# EAGLE design PowerBus (EAGLE 7.7.0)
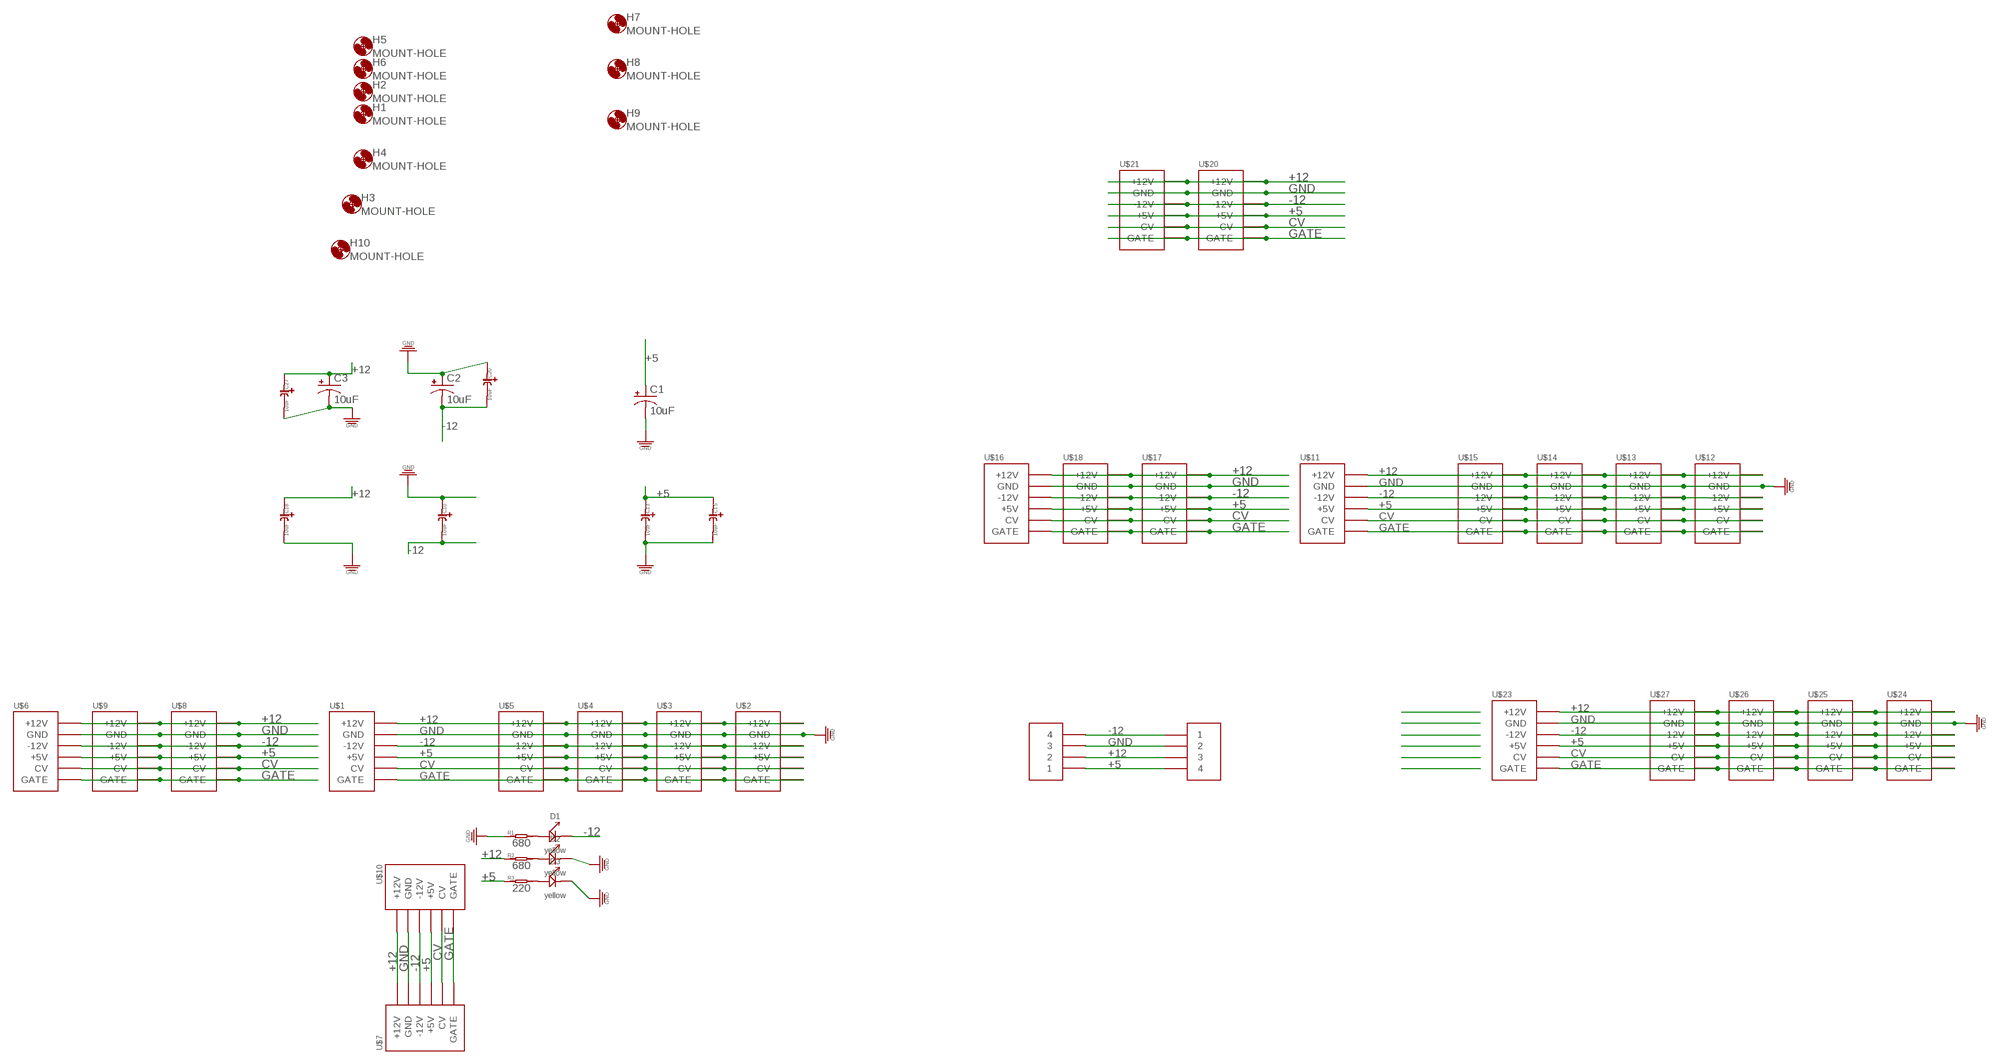
[diagram p0: schematic, sheet 1]

## Parts
C1  10uF  CAP_POLD  [PANASONIC_D]
C2  10uF  CAP_POLD  [PANASONIC_D]
C3  10uF  CAP_POLD  [PANASONIC_D]
C10  10uF  C-POLAR-A  [CASE-A_3216]
C13  10uF  C-POLAR-A  [CASE-A_3216]
C15  10uF  C-POLAR-A  [CASE-A_3216]
C18  10uF  C-POLAR-A  [CASE-A_3216]
C20  10uF  C-POLAR-A  [CASE-A_3216]
C27  10uF  C-POLAR-A  [CASE-A_3216]
D1  yellow  LED  [LED0603]
D2  yellow  LED  [LED0603]
D3  yellow  LED  [LED0603]
H1  MOUNT-HOLE  [3.2-NOMARKINGS-SMALLSAFEZONE]
H2  MOUNT-HOLE  [3.2-NOMARKINGS-SMALLSAFEZONE]
H3  MOUNT-HOLE  [3.2-NOMARKINGS-SMALLSAFEZONE]
H4  MOUNT-HOLE  [3.2-NOMARKINGS-SMALLSAFEZONE]
H5  MOUNT-HOLE  [3.2-NOMARKINGS-SMALLSAFEZONE]
H6  MOUNT-HOLE  [3.2-NOMARKINGS-SMALLSAFEZONE]
H7  MOUNT-HOLE  [3.2-NOMARKINGS-SMALLSAFEZONE]
H8  MOUNT-HOLE  [3.2-NOMARKINGS-SMALLSAFEZONE]
H9  MOUNT-HOLE  [3.2-NOMARKINGS-SMALLSAFEZONE]
H10  MOUNT-HOLE  [3.2-NOMARKINGS-SMALLSAFEZONE]
R1  680  R-0603  [R0603]
R2  680  R-0603  [R0603]
R3  220  R-0603  [R0603]
U$1  POWER_SHROUDED_NOTEXT  [POWER_16_SHROUDED_NOTEXT]
U$2  POWER_SHROUDED_NOTEXT  [POWER_16_SHROUDED_NOTEXT]
U$3  POWER_SHROUDED_NOTEXT  [POWER_16_SHROUDED_NOTEXT]
U$4  POWER_SHROUDED_NOTEXT  [POWER_16_SHROUDED_NOTEXT]
U$5  POWER_SHROUDED_NOTEXT  [POWER_16_SHROUDED_NOTEXT]
U$6  POWER_SHROUDED_NOTEXT  [POWER_16_SHROUDED_NOTEXT]
U$7  POWER_SHROUDED_NOTEXT  [POWER_16_SHROUDED_NOTEXT]
U$8  POWER_SHROUDED_NOTEXT  [POWER_16_SHROUDED_NOTEXT]
U$9  POWER_SHROUDED_NOTEXT  [POWER_16_SHROUDED_NOTEXT]
U$10  POWER_SHROUDED_NOTEXT  [POWER_16_SHROUDED_NOTEXT]
U$11  POWER_SHROUDED_NOTEXT  [POWER_16_SHROUDED_NOTEXT]
U$12  POWER_SHROUDED_NOTEXT  [POWER_16_SHROUDED_NOTEXT]
U$13  POWER_SHROUDED_NOTEXT  [POWER_16_SHROUDED_NOTEXT]
U$14  POWER_SHROUDED_NOTEXT  [POWER_16_SHROUDED_NOTEXT]
U$15  POWER_SHROUDED_NOTEXT  [POWER_16_SHROUDED_NOTEXT]
U$16  POWER_SHROUDED_NOTEXT  [POWER_16_SHROUDED_NOTEXT]
U$17  POWER_SHROUDED_NOTEXT  [POWER_16_SHROUDED_NOTEXT]
U$18  POWER_SHROUDED_NOTEXT  [POWER_16_SHROUDED_NOTEXT]
U$19  4PIN5MM  [4PIN5MM]
U$20  POWER_SHROUDED_NOTEXT  [POWER_16_SHROUDED_NOTEXT]
U$21  POWER_SHROUDED_NOTEXT  [POWER_16_SHROUDED_NOTEXT]
U$22  4PIN5MM  [4PIN5MM]
U$23  POWER_SHROUDED_NOTEXT  [POWER_16_SHROUDED_NOTEXT]
U$24  POWER_SHROUDED_NOTEXT  [POWER_16_SHROUDED_NOTEXT]
U$25  POWER_SHROUDED_NOTEXT  [POWER_16_SHROUDED_NOTEXT]
U$26  POWER_SHROUDED_NOTEXT  [POWER_16_SHROUDED_NOTEXT]
U$27  POWER_SHROUDED_NOTEXT  [POWER_16_SHROUDED_NOTEXT]

## Nets
+5 [Powertrace]: C1.+ C13.+ C15.+ R3.1 U$1.11(+5V) U$1.12(+5V) U$2.11(+5V) U$2.12(+5V) U$3.11(+5V) U$3.12(+5V) U$4.11(+5V) U$4.12(+5V) U$5.11(+5V) U$5.12(+5V) U$6.11(+5V) U$6.12(+5V) U$7.11(+5V) U$7.12(+5V) U$8.11(+5V) U$8.12(+5V) U$9.11(+5V) U$9.12(+5V) U$10.11(+5V) U$10.12(+5V) U$11.11(+5V) U$11.12(+5V) U$12.11(+5V) U$12.12(+5V) U$13.11(+5V) U$13.12(+5V) U$14.11(+5V) U$14.12(+5V) U$15.11(+5V) U$15.12(+5V) U$16.11(+5V) U$16.12(+5V) U$17.11(+5V) U$17.12(+5V) U$18.11(+5V) U$18.12(+5V) U$19.4 U$20.11(+5V) U$20.12(+5V) U$21.11(+5V) U$21.12(+5V) U$22.1 U$23.11(+5V) U$23.12(+5V) U$24.11(+5V) U$24.12(+5V) U$25.11(+5V) U$25.12(+5V) U$26.11(+5V) U$26.12(+5V) U$27.11(+5V) U$27.12(+5V)
+12 [Powertrace]: C3.+ C18.+ C27.+ R2.1 U$1.9(+12V) U$1.10(+12V) U$2.9(+12V) U$2.10(+12V) U$3.9(+12V) U$3.10(+12V) U$4.9(+12V) U$4.10(+12V) U$5.9(+12V) U$5.10(+12V) U$6.9(+12V) U$6.10(+12V) U$7.9(+12V) U$7.10(+12V) U$8.9(+12V) U$8.10(+12V) U$9.9(+12V) U$9.10(+12V) U$10.9(+12V) U$10.10(+12V) U$11.9(+12V) U$11.10(+12V) U$12.9(+12V) U$12.10(+12V) U$13.9(+12V) U$13.10(+12V) U$14.9(+12V) U$14.10(+12V) U$15.9(+12V) U$15.10(+12V) U$16.9(+12V) U$16.10(+12V) U$17.9(+12V) U$17.10(+12V) U$18.9(+12V) U$18.10(+12V) U$19.3 U$20.9(+12V) U$20.10(+12V) U$21.9(+12V) U$21.10(+12V) U$22.2 U$23.9(+12V) U$23.10(+12V) U$24.9(+12V) U$24.10(+12V) U$25.9(+12V) U$25.10(+12V) U$26.9(+12V) U$26.10(+12V) U$27.9(+12V) U$27.10(+12V)
-12 [Powertrace]: C2.- C10.- C20.- D1.- U$1.1(-12V) U$1.2(-12V) U$2.1(-12V) U$2.2(-12V) U$3.1(-12V) U$3.2(-12V) U$4.1(-12V) U$4.2(-12V) U$5.1(-12V) U$5.2(-12V) U$6.1(-12V) U$6.2(-12V) U$7.1(-12V) U$7.2(-12V) U$8.1(-12V) U$8.2(-12V) U$9.1(-12V) U$9.2(-12V) U$10.1(-12V) U$10.2(-12V) U$11.1(-12V) U$11.2(-12V) U$12.1(-12V) U$12.2(-12V) U$13.1(-12V) U$13.2(-12V) U$14.1(-12V) U$14.2(-12V) U$15.1(-12V) U$15.2(-12V) U$16.1(-12V) U$16.2(-12V) U$17.1(-12V) U$17.2(-12V) U$18.1(-12V) U$18.2(-12V) U$19.1 U$20.1(-12V) U$20.2(-12V) U$21.1(-12V) U$21.2(-12V) U$22.4 U$23.1(-12V) U$23.2(-12V) U$24.1(-12V) U$24.2(-12V) U$25.1(-12V) U$25.2(-12V) U$26.1(-12V) U$26.2(-12V) U$27.1(-12V) U$27.2(-12V)
CV [Powertrace]: U$1.13(CV) U$1.14(CV) U$2.13(CV) U$2.14(CV) U$3.13(CV) U$3.14(CV) U$4.13(CV) U$4.14(CV) U$5.13(CV) U$5.14(CV) U$6.13(CV) U$6.14(CV) U$7.13(CV) U$7.14(CV) U$8.13(CV) U$8.14(CV) U$9.13(CV) U$9.14(CV) U$10.13(CV) U$10.14(CV) U$11.13(CV) U$11.14(CV) U$12.13(CV) U$12.14(CV) U$13.13(CV) U$13.14(CV) U$14.13(CV) U$14.14(CV) U$15.13(CV) U$15.14(CV) U$16.13(CV) U$16.14(CV) U$17.13(CV) U$17.14(CV) U$18.13(CV) U$18.14(CV) U$20.13(CV) U$20.14(CV) U$21.13(CV) U$21.14(CV) U$23.13(CV) U$23.14(CV) U$24.13(CV) U$24.14(CV) U$25.13(CV) U$25.14(CV) U$26.13(CV) U$26.14(CV) U$27.13(CV) U$27.14(CV)
GATE [Powertrace]: U$1.15(GATE) U$1.16(GATE) U$2.15(GATE) U$2.16(GATE) U$3.15(GATE) U$3.16(GATE) U$4.15(GATE) U$4.16(GATE) U$5.15(GATE) U$5.16(GATE) U$6.15(GATE) U$6.16(GATE) U$7.15(GATE) U$7.16(GATE) U$8.15(GATE) U$8.16(GATE) U$9.15(GATE) U$9.16(GATE) U$10.15(GATE) U$10.16(GATE) U$11.15(GATE) U$11.16(GATE) U$12.15(GATE) U$12.16(GATE) U$13.15(GATE) U$13.16(GATE) U$14.15(GATE) U$14.16(GATE) U$15.15(GATE) U$15.16(GATE) U$16.15(GATE) U$16.16(GATE) U$17.15(GATE) U$17.16(GATE) U$18.15(GATE) U$18.16(GATE) U$20.15(GATE) U$20.16(GATE) U$21.15(GATE) U$21.16(GATE) U$23.15(GATE) U$23.16(GATE) U$24.15(GATE) U$24.16(GATE) U$25.15(GATE) U$25.16(GATE) U$26.15(GATE) U$26.16(GATE) U$27.15(GATE) U$27.16(GATE)
GND: C1.- C2.+ C3.- C10.+ C13.- C15.- C18.- C20.+ C27.- D2.- D3.- R1.1 U$1.3(GND) U$1.4(GND) U$1.5(GND) U$1.6(GND) U$1.7(GND) U$1.8(GND) U$2.3(GND) U$2.4(GND) U$2.5(GND) U$2.6(GND) U$2.7(GND) U$2.8(GND) U$3.3(GND) U$3.4(GND) U$3.5(GND) U$3.6(GND) U$3.7(GND) U$3.8(GND) U$4.3(GND) U$4.4(GND) U$4.5(GND) U$4.6(GND) U$4.7(GND) U$4.8(GND) U$5.3(GND) U$5.4(GND) U$5.5(GND) U$5.6(GND) U$5.7(GND) U$5.8(GND) U$6.3(GND) U$6.4(GND) U$6.5(GND) U$6.6(GND) U$6.7(GND) U$6.8(GND) U$7.3(GND) U$7.4(GND) U$7.5(GND) U$7.6(GND) U$7.7(GND) U$7.8(GND) U$8.3(GND) U$8.4(GND) U$8.5(GND) U$8.6(GND) U$8.7(GND) U$8.8(GND) U$9.3(GND) U$9.4(GND) U$9.5(GND) U$9.6(GND) U$9.7(GND) U$9.8(GND) U$10.3(GND) U$10.4(GND) U$10.5(GND) U$10.6(GND) U$10.7(GND) U$10.8(GND) U$11.3(GND) U$11.4(GND) U$11.5(GND) U$11.6(GND) U$11.7(GND) U$11.8(GND) U$12.3(GND) U$12.4(GND) U$12.5(GND) U$12.6(GND) U$12.7(GND) U$12.8(GND) U$13.3(GND) U$13.4(GND) U$13.5(GND) U$13.6(GND) U$13.7(GND) U$13.8(GND) U$14.3(GND) U$14.4(GND) U$14.5(GND) U$14.6(GND) U$14.7(GND) U$14.8(GND) U$15.3(GND) U$15.4(GND) U$15.5(GND) U$15.6(GND) U$15.7(GND) U$15.8(GND) U$16.3(GND) U$16.4(GND) U$16.5(GND) U$16.6(GND) U$16.7(GND) U$16.8(GND) U$17.3(GND) U$17.4(GND) U$17.5(GND) U$17.6(GND) U$17.7(GND) U$17.8(GND) U$18.3(GND) U$18.4(GND) U$18.5(GND) U$18.6(GND) U$18.7(GND) U$18.8(GND) U$19.2 U$20.3(GND) U$20.4(GND) U$20.5(GND) U$20.6(GND) U$20.7(GND) U$20.8(GND) U$21.3(GND) U$21.4(GND) U$21.5(GND) U$21.6(GND) U$21.7(GND) U$21.8(GND) U$22.3 U$23.3(GND) U$23.4(GND) U$23.5(GND) U$23.6(GND) U$23.7(GND) U$23.8(GND) U$24.3(GND) U$24.4(GND) U$24.5(GND) U$24.6(GND) U$24.7(GND) U$24.8(GND) U$25.3(GND) U$25.4(GND) U$25.5(GND) U$25.6(GND) U$25.7(GND) U$25.8(GND) U$26.3(GND) U$26.4(GND) U$26.5(GND) U$26.6(GND) U$26.7(GND) U$26.8(GND) U$27.3(GND) U$27.4(GND) U$27.5(GND) U$27.6(GND) U$27.7(GND) U$27.8(GND)
N$1: D1.+ R1.2
N$2: D2.+ R2.2
N$3: D3.+ R3.2

## Library data of the parts
C1-C3 = SparkFun-Capacitors:CAP_POL: Capacitor Polarized These are standard SMD and PTH capacitors. Normally 10uF, 47uF, and 100uF in electrolytic and tantalum varieties. Always verify the external diameter of the through hole cap, it varies with capacity, voltage, and manufacturer. The EIA devices should be standard.
C10 C13 C15 C18 C20 C27 = EurorackModularParts:C-POLAR*
D1-D3 = OPL:LED*: LED
H1-H10 = zephod-components:MOUNT-HOLE: MOUNTING HOLE with drill center marker
R1-R3 = OPL:R*
U$1-U$18 U$20 U$21 U$23-U$27 = EurorackModularParts:POWER
U$19 U$22 = EurorackModularParts:4PIN5MM

## Net classes
0 default: width 0.254 mm, clearance 0.381 mm
1 Powertrace: width 1 mm

## Board
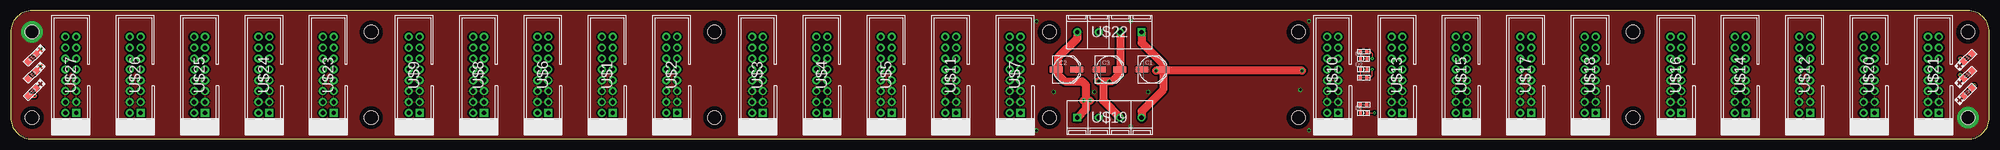
[diagram p1: board, top side]
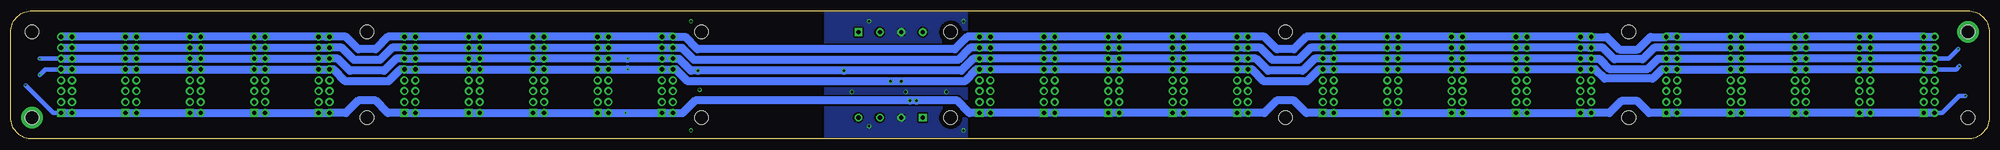
[diagram p2: board, bottom side, seen from below]

Size 461 x 30 mm. Coordinates in mm from the lower left corner, seen from the top.
Outline: 0,25 0,5 arc90 5,0 456,0 arc90 461,5 461,25 arc90 456,30 5,30 arc90 0,25
Copper layers (1*16): Top 0.035mm / dielectric 1.5mm / Bottom 0.035mm
Design rules "dirt_cheap_dirty_boards.v1": minimum track width 5mil, minimum drill 12mil, track to track 5mil, track to pad 5mil, pad to pad 5mil, via to via 5mil, smd to smd 0mil, copper to edge 10mil, drill to drill 10mil, minimum pad ring 10mil, minimum via ring 6mil, stop-mask expansion 2mil, vias tented up to drill 25mil, thermal gap 10mil
Holes 3.2 mm at 5,25 456,5

### Footprints (pad centres in the part's own frame; a part is rotated, then mirrored left to right if it is on the bottom)
PANASONIC_D = smd 3 x 1.4: + 2.4,0; - -2.4,0
CASE-A_3216 = smd 1.27 x 1.27: + -1.27,0; - 1.27,0
LED0603 = smd 0.762 x 0.889: + -0.762,0; - 0.762,0
3.2-NOMARKINGS-SMALLSAFEZONE = hole 3.2: 0,0
R0603 = smd 0.889 x 0.889: 1 -0.762,0; 2 0.762,0
POWER_16_SHROUDED_NOTEXT = drill 1.016 pad 1.88 square: 1 -8.89,-1.27 | drill 1.016 pad 1.88: 2 -8.89,1.27; 3 -6.35,-1.27; 4 -6.35,1.27; 5 -3.81,-1.27; 6 -3.81,1.27; 7 -1.27,-1.27; 8 -1.27,1.27; 9 1.27,-1.27; 10 1.27,1.27; 11 3.81,-1.27; 12 3.81,1.27; 13 6.35,-1.27; 14 6.35,1.27; 15 8.89,-1.27; 16 8.89,1.27
4PIN5MM = drill 1.016 pad 1.778 square: 1 -7.5,0 | drill 1.016 pad 1.778: 2 -2.5,0; 3 2.5,0; 4 7.5,0

### Placement (x,y rotation side)
C1  266,16.24 0 top
C2  246,16.24 0 top
C3  256,16.24 0 top
C10  5,11 225 top
C13  456,19 45 top
C15  5,19 225 top
C18  456,15 45 top
C20  456,11 45 top
C27  5,15 225 top
D1  315.21,6.1 0 top
D2  315.21,16.26 0 top
D3  315.21,18.8 0 top
H1  5,5 0 top
H2  378,5 0 top
H3  84,5 0 top
H4  378,25 0 top
H5  242,25 0 top
H6  242,5 0 top
H7  164,25 0 top
H8  164,5 0 top
H9  456,25 0 top
H10  84,25 0 top
H11  MOUNT-HOLE  [3.2-NOMARKINGS-SMALLSAFEZONE]  300,25 0 top
H12  MOUNT-HOLE  [3.2-NOMARKINGS-SMALLSAFEZONE]  300,5 0 top
R1  315.21,8 180 top
R2  315.21,14.35 180 top
R3  315.21,20.45 180 top
U$1  139,15 90 top
U$2  154,15 90 top
U$3  174,15 90 top
U$4  189,15 90 top
U$5  204,15 90 top
U$6  124,15 90 top
U$7  234,15 90 top
U$8  109,15 90 top
U$9  94,15 90 top
U$10  308,15 90 top
U$11  219,15 90 top
U$12  418,15 90 top
U$13  323,15 90 top
U$14  403,15 90 top
U$15  338,15 90 top
U$16  388,15 90 top
U$17  353,15 90 top
U$18  368,15 90 top
U$19  256,5 0 top
U$20  433,15 90 top
U$21  448,15 90 top
U$22  256,25 180 top
U$23  74,15 90 top
U$24  59,15 90 top
U$25  44,15 90 top
U$26  29,15 90 top
U$27  14,15 90 top

### Tracks (layer width: path | path; a pad name or v marks a point on that pad's centre or on a via)
+5  (via drill 0.3, 0.61)
  Top 0.254: R3.1 316.73,20.45 317.24,19.94 v317.24,18.81
  Top 0.508: v266.87,16 268.53,16.01 C1.+ 268.4,16.6 268.5,16.5
  Top 1: v7.21,21.08 7.08,21.08 C15.+ | v454.25,18.8 454.41,18.8 C13.+
  Top 1.87: U$22.1 263.5,22.5 268.5,17.5 268.5,16.5 268.5,11.5 263.5,6.5 U$19.4 | v300.9,16 v266.87,16
  Bottom 1: U$27.12 9.48,18.81 v7.21,21.08 | U$21.11 454.23,18.81 v454.25,18.8
  Bottom 1.87: U$21.11 U$21.12 U$20.11 U$20.12 U$12.11 U$12.12 U$14.11 U$14.12 U$16.11 U$16.12 | U$18.11 U$18.12 U$17.11 U$17.12 U$15.11 U$15.12 U$13.11 U$13.12 v317.24,18.81 U$10.11 U$10.12 305.31,18.81 302.5,16 v300.9,16 v266.87,16 239.5,16 236.69,18.81 U$7.11 U$7.12 U$11.11 U$11.12 U$5.11 U$5.12 U$4.11 U$4.12 U$3.11 173.5,18.81 U$3.12 | U$2.11 U$2.12 U$1.11 U$1.12 U$6.11 U$6.12 U$8.11 U$8.12 U$9.11 U$9.12 90.91,18.81 88.49,16.38 79.6,16.38 77.18,18.8 75.28,18.8 U$23.11 U$23.12 U$24.11 U$24.12 U$25.11 U$25.12 U$26.11 U$26.12 U$27.11 U$27.12
  Bottom 1.88: U$2.11 157.19,18.81 160,16 168,16 170.81,18.81 173.5,18.81 | U$18.11 371.19,18.81 374,16 382,16 384.81,18.81 U$16.12
+12  (via drill 0.3, 0.61)
  Top 0.254: R2.1 316.73,14.35 317.24,14.86 v317.24,16.27
  Top 0.508: C3.+ 258.4,16.1 258.5,16
  Top 1: v6.95,17.02 6.95,16.95 C27.+ | v454.25,14.99 454.25,14.96 C18.+
  Top 1.87: U$22.2 258.5,16 258.5,15.5 256.48,13.48 254.48,13.48 254.5,13.5 | 254.5,13.5 254.5,9 U$19.3 | 254.5,13.5 v253.5,13.5 v256,13.5
  Bottom 1: U$27.10 7.7,16.27 v6.95,17.02 | U$21.9 452.96,16.27 v454.25,14.99
  Bottom 1.87: U$21.9 U$21.10 U$20.9 U$20.10 U$12.9 U$12.10 U$14.9 U$14.10 U$16.9 U$16.10 | U$18.9 U$18.10 U$17.9 U$17.10 U$15.9 U$15.10 U$13.9 U$13.10 v317.24,16.27 U$10.9 U$10.10 306.02,16.27 303.25,13.5 v256,13.5 v253.5,13.5 238.75,13.5 235.98,16.27 U$7.9 U$7.10 U$11.9 U$11.10 U$5.9 U$5.10 U$4.9 U$4.10 U$3.9 U$3.10 | U$9.10 93.31,16.27 | 93.31,16.27 U$9.9 U$8.10 U$8.9 U$6.10 U$6.9 U$1.10 U$1.9 U$2.10 U$2.9 | U$27.10 U$27.9 U$26.10 U$26.9 U$25.10 U$25.9 U$24.10 U$24.9 U$23.10 U$23.9 76.28,16.27 78.45,14.1 89.63,14.1 91.79,16.26 93.3,16.26 93.31,16.27
  Bottom 1.88: U$2.9 156.23,16.27 159,13.5 169,13.5 171.77,16.27 U$3.10 | U$18.9 370.23,16.27 373,13.5 383,13.5 385.77,16.27 U$16.10
-12  (via drill 0.3, 0.61)
  Top 0.254: D1.- 317.74,6.1 v317.75,6.11
  Top 0.508: 250.5,10.5 250.24,10.24 250,10.24 v250,9 | 244,15.12 244,16.6 C2.-
  Top 1: v5.56,10.1 C10.- | v457.55,12.57 457.55,12.55 C20.-
  Top 1.87: U$22.4 248.5,23.5 244,19 244,15.12 245.63,13.48 249.63,13.48 250.5,12.62 250.5,10.5 250.5,7 U$19.1 | v250,9 v251.5,9
  Bottom 1: 306.62,6 U$10.2 | U$27.2 10.94,6.11 6.95,10.1 v5.56,10.1 | U$21.1 451.09,6.11 v457.55,12.57
  Bottom 1.87: U$16.2 U$16.1 U$14.2 U$14.1 U$12.2 U$12.1 U$20.2 U$20.1 U$21.2 U$21.1 | U$18.1 U$18.2 U$17.1 U$17.2 U$15.1 U$15.2 U$13.1 U$13.2 v317.75,6.11 U$10.1 U$10.2 | U$2.1 U$2.2 U$1.1 U$1.2 U$6.1 U$6.2 U$8.1 U$8.2 U$9.1 93.31,6.11 | 93.31,6.11 U$9.2 | U$3.2 U$3.1 U$4.2 U$4.1 U$5.2 U$5.1 U$11.2 U$11.1 U$7.2 U$7.1 237.61,6.11 240.5,9 v250,9 v251.5,9 301.5,9 304.5,6 306.62,6 | U$27.2 U$27.1 U$26.2 U$26.1 U$25.2 U$25.1 U$24.2 U$24.1 U$23.2 U$23.1 79.23,6.11 82.01,8.89 85.69,8.89 88.49,6.1 93.3,6.1 93.31,6.11
  Bottom 1.88: U$2.1 159.11,6.11 162,9 166,9 168.89,6.11 U$3.2 | U$18.1 373.11,6.11 376,9 380,9 382.89,6.11 U$16.2
CV
  Bottom 1.87: U$9.14 93.31,21.35 | 93.31,21.35 U$9.13 U$8.14 U$8.13 U$6.14 U$6.13 U$1.14 U$1.13 U$2.14 U$2.13 | U$21.13 U$21.14 U$20.13 U$20.14 U$12.13 U$12.14 U$14.13 U$14.14 U$16.13 U$16.14 | U$18.13 U$18.14 U$17.13 U$17.14 U$15.13 U$15.14 U$13.13 U$13.14 U$10.13 U$10.14 304.6,21.35 301.75,18.5 240.25,18.5 237.4,21.35 U$7.13 U$7.14 U$11.13 U$11.14 U$5.13 U$5.14 U$4.13 U$4.14 U$3.13 173.5,21.35 U$3.14 | U$27.14 U$27.13 U$26.14 U$26.13 U$25.14 U$25.13 U$24.14 U$24.13 U$23.14 U$23.13 78.06,21.35 80.74,18.67 87.34,18.67 90.01,21.34 93.3,21.34 93.31,21.35
  Bottom 1.88: U$2.13 158.15,21.35 161,18.5 167,18.5 169.85,21.35 173.5,21.35 | U$18.13 372.15,21.35 375,18.5 381,18.5 383.85,21.35 U$16.14
GATE
  Bottom 1.87: U$9.16 U$9.15 | U$9.15 U$8.16 U$8.15 U$6.16 U$6.15 U$1.16 U$1.15 U$2.16 U$2.15 | U$18.15 U$18.16 U$17.15 U$17.16 U$15.15 U$15.16 U$13.15 U$13.16 U$10.15 U$10.16 303.88,23.89 300.99,21 241.01,21 238.12,23.89 U$7.15 U$7.16 U$11.15 U$11.16 U$5.15 U$5.16 U$4.15 U$4.16 U$3.15 U$3.16 | U$16.16 387.5,23.89 U$16.15 U$14.16 U$14.15 U$12.16 U$12.15 U$20.16 U$20.15 U$21.16 U$21.15 | U$9.15 95.33,23.89 95.34,23.88 89.12,23.88 86.2,20.95 81.88,20.95 78.96,23.88 75.28,23.88 U$23.15 U$23.16 U$24.15 U$24.16 U$25.15 U$25.16 U$26.15 U$26.16 U$27.15 U$27.16
  Bottom 1.88: U$2.15 159.11,23.89 162,21 166,21 168.89,23.89 U$3.16 | U$18.15 373.11,23.89 376,21 380,21 382.89,23.89 387.5,23.89
GND  (via drill 0.61, 3.2 pad 5)
  other vias: 239,27.5 243,11 239,2 252.5,11 265,11 300.5,11.5 302.5,27.5 261,27.5 261,3 302.5,2 5,25 456,5
  pour Top: 0,31 456,30 arc-90 461,25 461,0 5,0 arc-90 0,5
  pour Bottom: 238.5,30 271,30 271,0 238.5,0
N$1
  Top 0.254: D1.+ R1.2
N$2
  Top 0.254: D2.+ R2.2
N$3
  Top 0.254: R3.2 314.57,18.54 D3.+